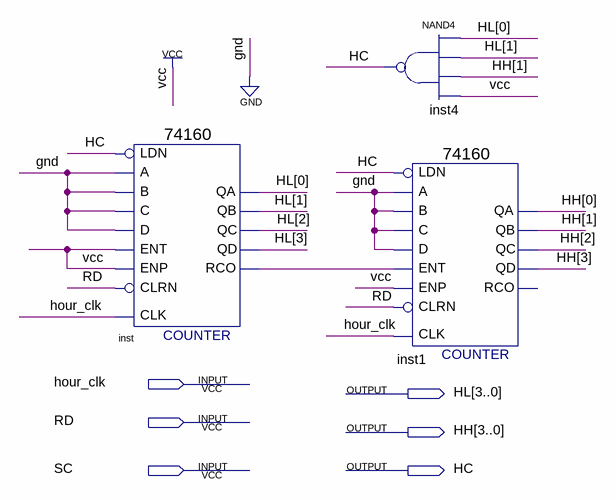
[diagram p0: schematic sheet]
// Quartus schematic hour.bdf as structural Verilog: 3 symbols, 6 pins
module hour (
  input  hour_clk,
  input  RD,
  input  SC,
  output [3:0] HL,
  output [3:0] HH,
  output HC
);

  wire inst_rco;

  \74160  inst (
    .CLK(hour_clk), .ENT(1'b1), .A(1'b0), .B(1'b0), .C(1'b0), .D(1'b0), .LDN(HC), .ENP(1'b1), .CLRN(RD),
    .QD(HL[3]), .QA(HL[0]), .QB(HL[1]), .QC(HL[2]), .RCO(inst_rco));
  nand inst4 (HC, HL[0], HL[1], HH[1], 1'b1);
  \74160  inst1 (
    .CLK(hour_clk), .ENT(inst_rco), .A(1'b0), .B(1'b0), .C(1'b0), .D(1'b0), .LDN(HC), .ENP(1'b1), .CLRN(RD),
    .QD(HH[3]), .QA(HH[0]), .QB(HH[1]), .QC(HH[2]));  // open: RCO
endmodule
